# EAGLE schematic switchboard_eurobotics2010_r1 (EAGLE 4.16)
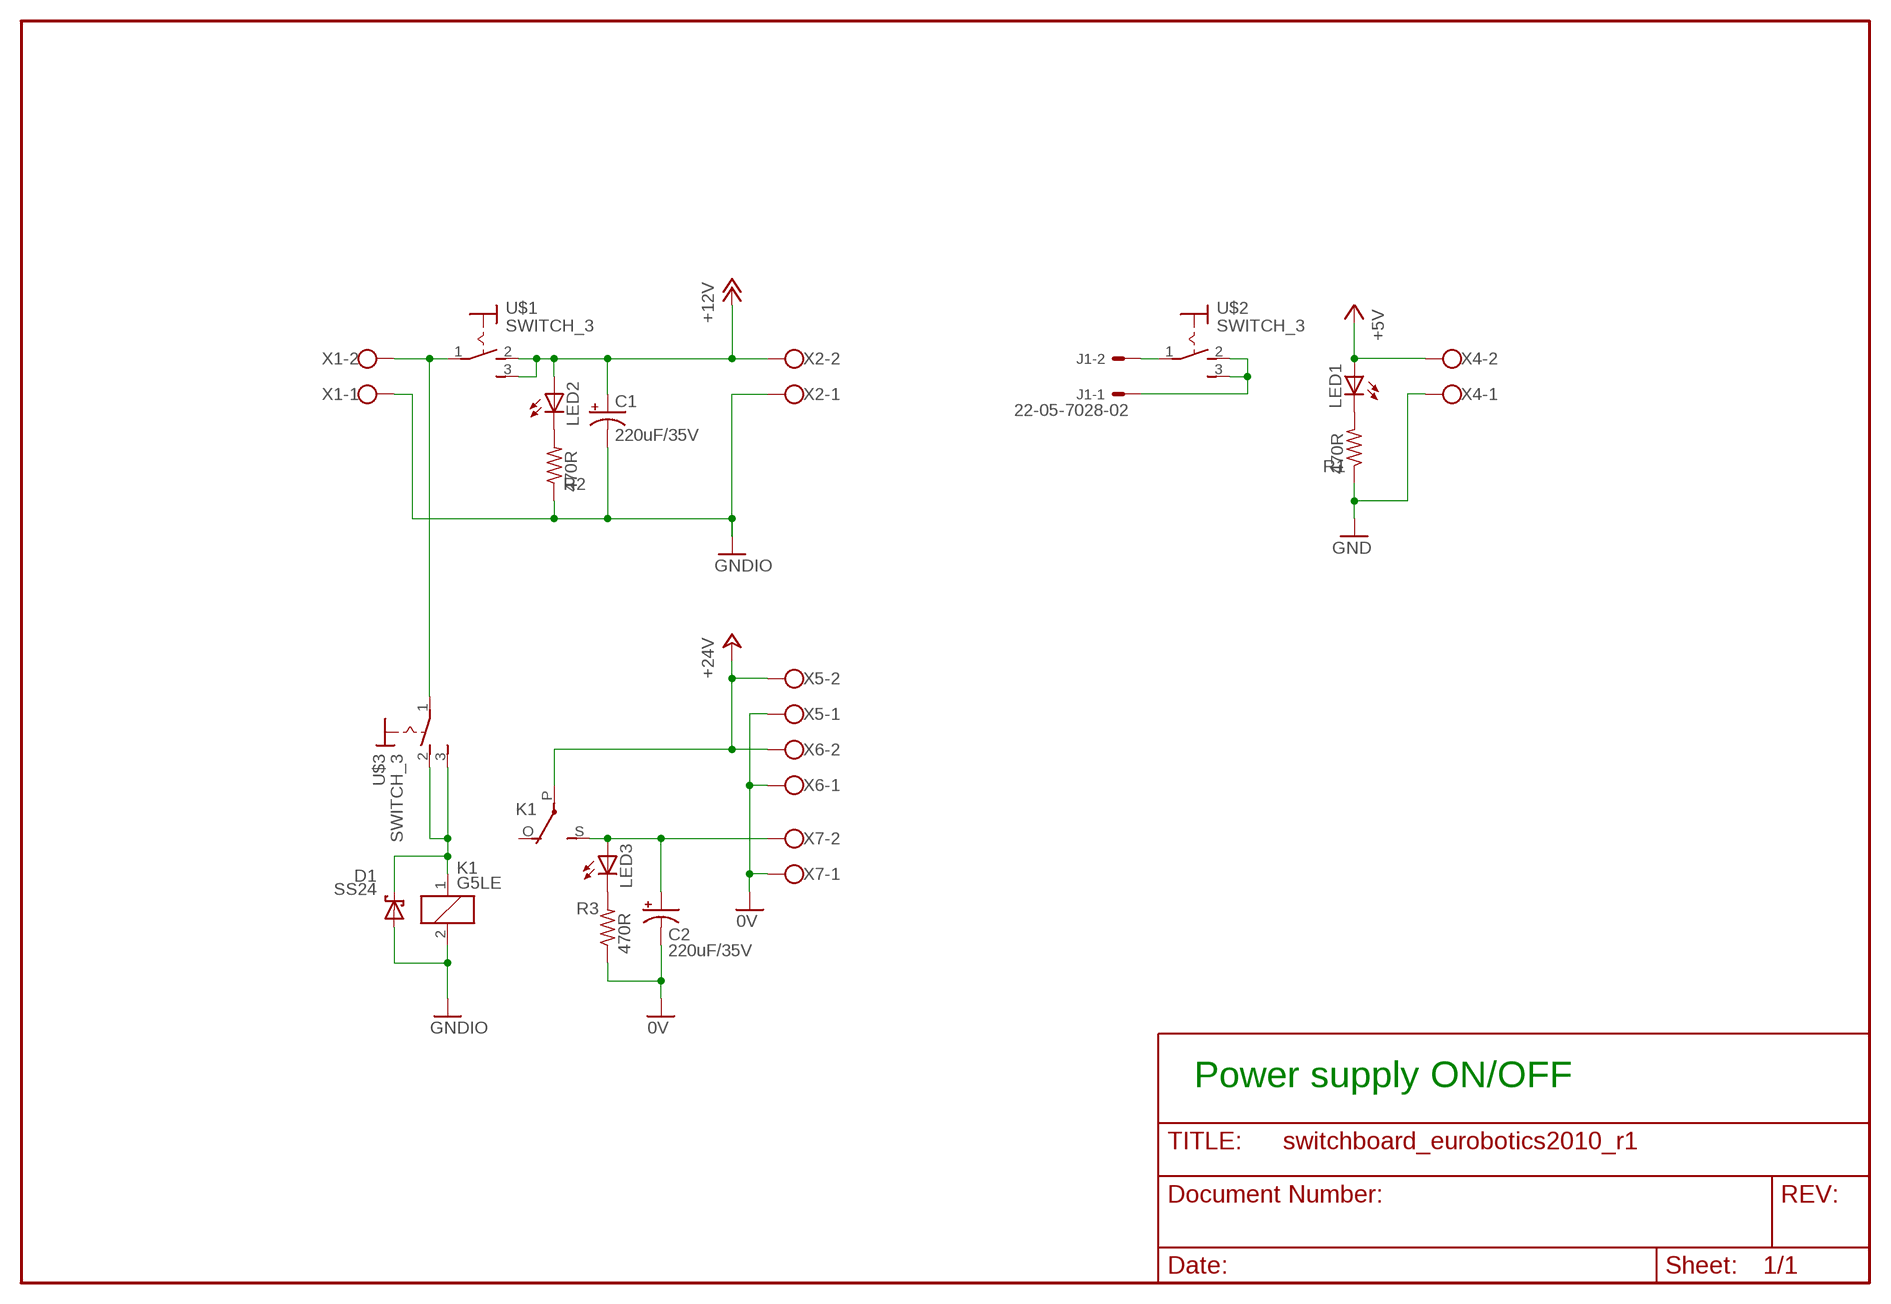
[diagram p0: schematic, sheet 1]

## Parts
C1  220uF/35V  CPOL-USE5-10.5  [E5-10,5]
C2  220uF/35V  CPOL-USE5-10.5  [E5-10,5]
D1  SS24  SCHOTTKY_SMB  [DIOM5436X265N]
J1  22-05-7028-02  [7395-02]
K1  G5LE  [G5LE]
LED1  LED3MM  [LED3MM]
LED2  LED3MM  [LED3MM]
LED3  LED3MM  [LED3MM]
R1  470R  R-US_R0805  [R0805]
R2  470R  R-US_R0805  [R0805]
R3  470R  R-US_R0805  [R0805]
U$1  SWITCH_3  [ROCKER_SWITCH]
U$2  SWITCH_3  [ROCKER_SWITCH]
U$3  SWITCH_3  [ROCKER_SWITCH]
X1  W237-02P  [W237-132]
X2  W237-02P  [W237-132]
X4  W237-02P  [W237-132]
X5  W237-02P  [W237-132]
X6  W237-02P  [W237-132]
X7  W237-02P  [W237-132]

## Nets
0V: C2.- R3.1 X5.1 X6.1 X7.1
+5V: LED1.A X4.2
+12V: C1.+ LED2.A U$1.2 U$1.3 X2.2
+24V: K1.P(2:P) X5.2 X6.2
GND: R1.1 X4.1
GNDIO: C1.- D1.A K1.2 R2.1 X1.1 X2.1
N$1: U$1.1 U$3.1 X1.2
N$2: J1.2 U$2.1
N$3: D1.K K1.1 U$3.2 U$3.3
N$4: J1.1 U$2.2 U$2.3
N$5: C2.+ K1.S(2:S) LED3.A X7.2
N$6: LED2.K(C) R2.2
N$7: LED1.K(C) R1.2
N$8: LED3.K(C) R3.2
Unconnected: K1.O(2:O)

## Notes on the sheet
- Power supply ON/OFF

## Library data of the parts
C1 C2 = rcl:CPOL-US: POLARIZED CAPACITOR, American symbol
D1 = ipc-7351-diode:SCHOTTKY_
J1 = con-molex:22-?-02: CONNECTOR wire to board 2.54 mm (.1 inch) pitch header
K1 = relay:G5LE: RELAY 1 x switch, 10 A/120 V AC, 8 A/30 V DC, Omron
LED1-LED3 = led:LED: LED OSRAM: - CHIPLED LG R971, LG N971, LY N971, LG Q971, LY Q971, LO R971, LY R971 LH N974, LH R974 LS Q976, LO Q976, LY Q976 LO Q996 - Hyper CHIPLED LW Q18S LB Q993, LB Q99A, LB R99A - SideLED LS A670, LO A670, LY A670, LG A670, LP A670 LB A673, LV A673, LT A673, LW A673 LH A674 LY A675 LS A676, LA A676, LO A676, LY A676, LW A676 LS A679, LY A679, LG A679 - Hyper Micro SIDELED® LS Y876, LA Y876, LO Y876, LY Y876 LT Y87S - SmartLED LW L88C, LW L88S LB L89C, LB L89S, LG L890 LS L89K, LO L89K, LY L89K LS L896, LA L896, LO L896, LY L896 - TOPLED LS T670, LO T670, LY T670, LG T670, LP T670 LSG T670, LSP T670, LSY T670, LOP T670, LYG T670 LG T671, LOG T671, LSG T671 LB T673, LV T673, LT T673, LW T673 LH T674 LS T676, LA T676, LO T676, LY T676, LB T676, LH T676, LSB T676, LW T676 LB T67C, LV T67C, LT T67C, LS T67K, LO T67K, LY T67K, LW E67C LS E67B, LA E67B, LO E67B, LY E67B, LB E67C, LV E67C, LT E67C LW T67C LS T679, LY T679, LG T679 LS T770, LO T770, LY T770, LG T770, LP T770 LB T773, LV T773, LT T773, LW T773 LH T774 LS E675, LA E675, LY E675, LS T675 LS T776, LA T776, LO T776, LY T776, LB T776 LHGB T686 LT T68C, LB T68C - Hyper Mini TOPLED® LB M676 - Mini TOPLED Santana® LG M470 LS M47K, LO M47K, LY M47K Source: http://www.osram.convergy.de/
R1-R3 = rcl:R-US_: RESISTOR, American symbol
U$1-U$3 = temp_eagle_lib:SWITCH_3
X1 X2 X4-X7 = con-wago-508:W237-02P: WAGO SREW CLAMP